# EAGLE schematic switch_termi (EAGLE 7.5.0)
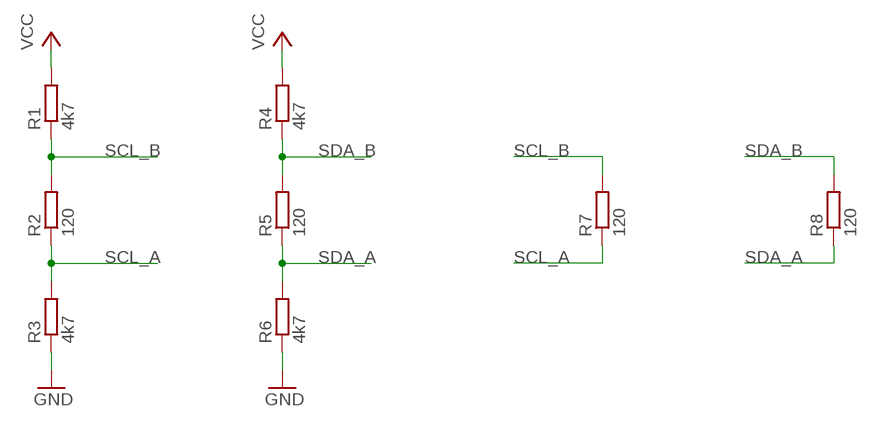
[diagram p0: schematic, sheet 1]

## Parts
R1  4k7  R-EU_R1206  [R1206]
R2  120  R-EU_R1206  [R1206]
R3  4k7  R-EU_R1206  [R1206]
R4  4k7  R-EU_R1206  [R1206]
R5  120  R-EU_R1206  [R1206]
R6  4k7  R-EU_R1206  [R1206]
R7  120  R-EU_R1206  [R1206]
R8  120  R-EU_R1206  [R1206]

## Nets
GND: R3.1 R6.1
SCL_A: R2.1 R3.2 R7.1
SCL_B: R1.1 R2.2 R7.2
SDA_A: R5.1 R6.2 R8.1
SDA_B: R4.1 R5.2 R8.2
VCC: R1.2 R4.2

## Library data of the parts
R1-R8 = resistor:R-EU_: RESISTOR, European symbol